# EAGLE design usb2pa_ppwing (EAGLE 6.5.0)
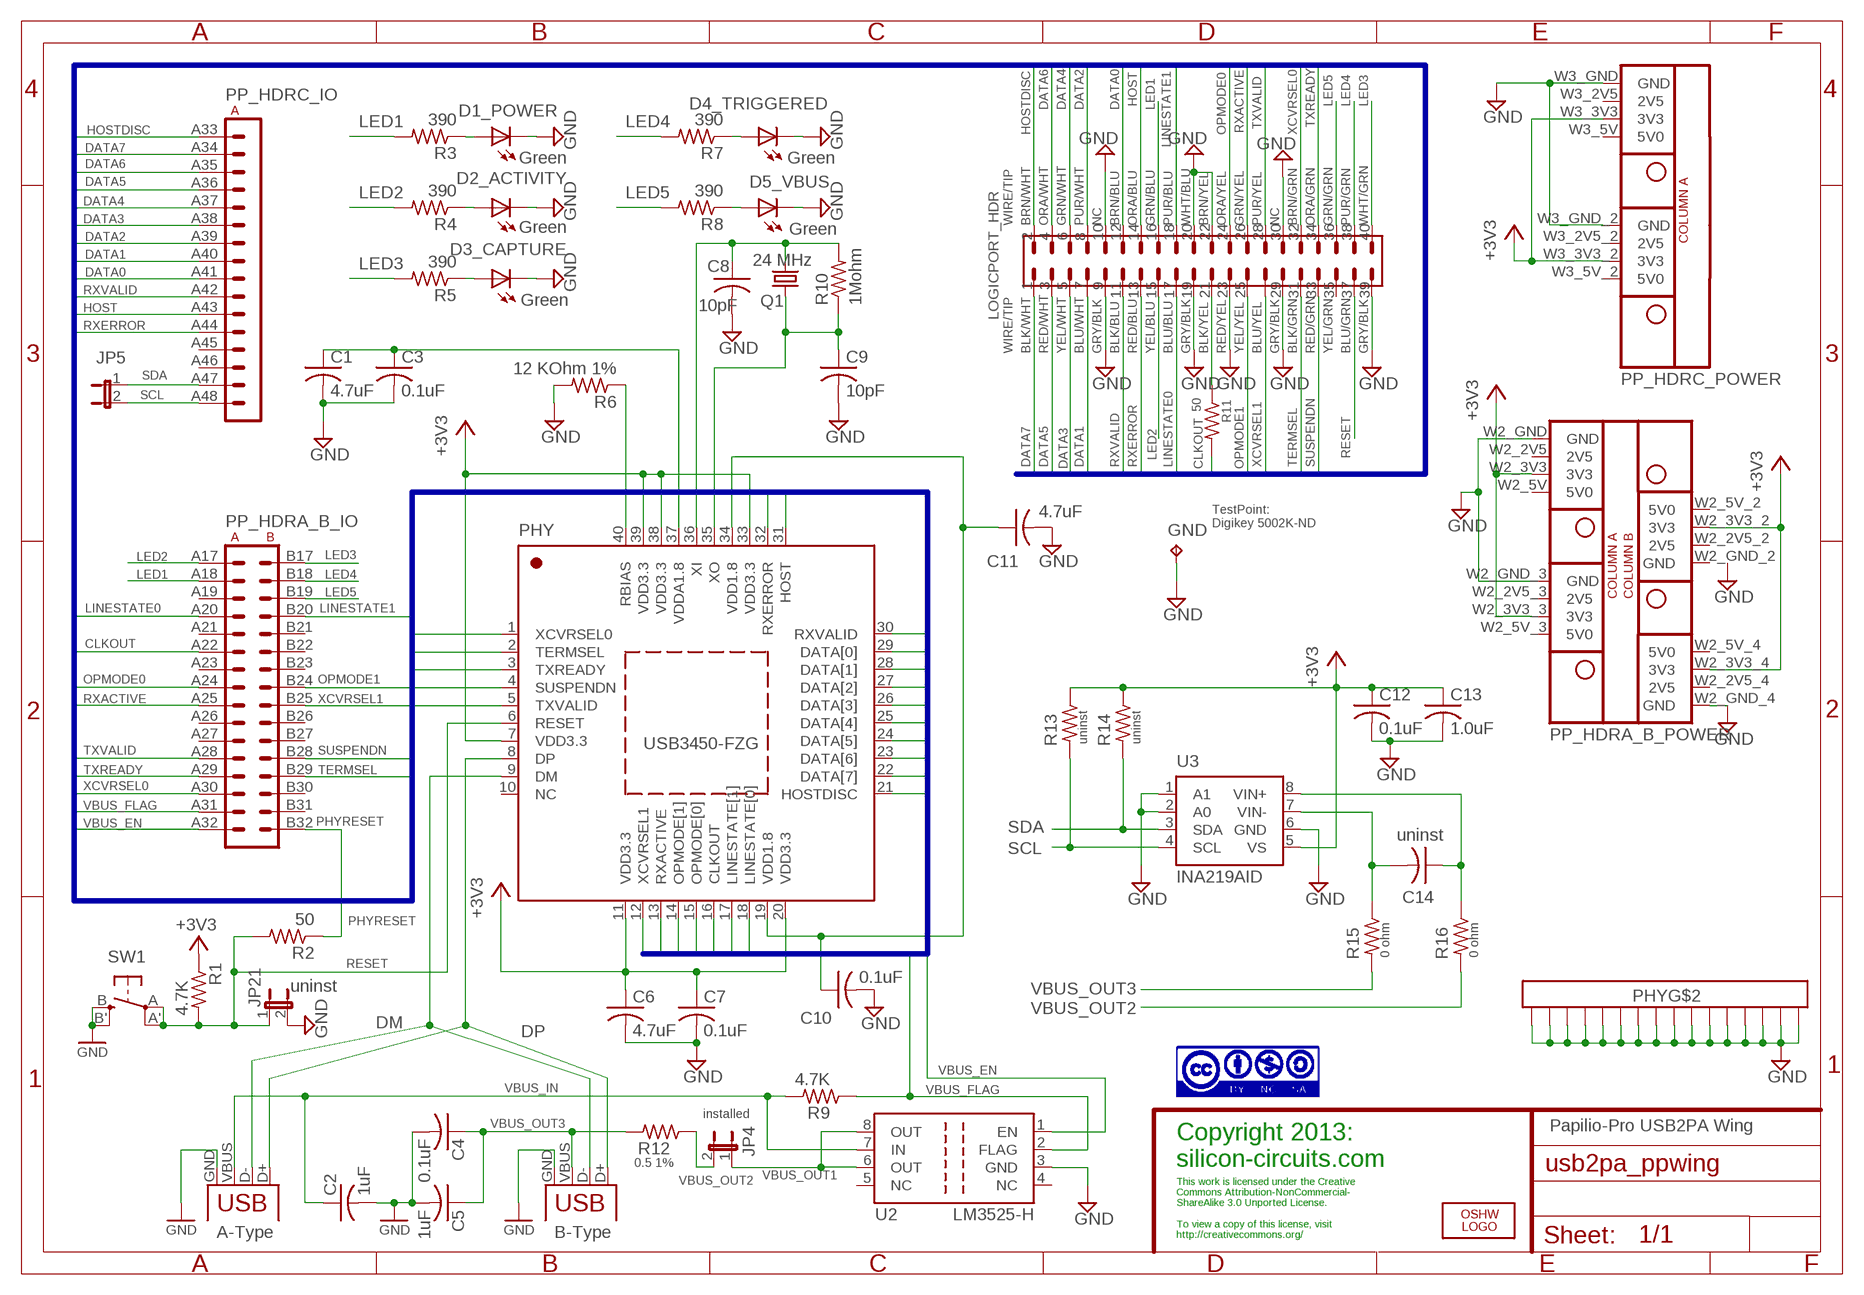
[diagram p0: schematic, sheet 1]

## Parts
C1  4.7uF  C-USC0805  [C0805]
C2  1uF  C-USC0805  [C0805]
C3  0.1uF  C-USC0805  [C0805]
C4  0.1uF  C-USC0805  [C0805]
C5  1uF  C-USC0805  [C0805]
C6  4.7uF  C-USC0805  [C0805]
C7  0.1uF  C-USC0805  [C0805]
C8  10pF  C-USC0805  [C0805]
C9  10pF  C-USC0805  [C0805]
C10  0.1uF  C-USC0805  [C0805]
C11  4.7uF  C-USC0805  [C0805]
C12  0.1uF  C-USC0805  [C0805]
C13  1.0uF  C-USC0805  [C0805]
C14  uninst  C-USC0805  [C0805]
CC_LICENSE  CC_LICENSE  [CC_LICENSE]
D1_POWER  Green  LEDCHIPLED_0805  [CHIPLED_0805]
D2_ACTIVITY  Green  LEDCHIPLED_0805  [CHIPLED_0805]
D3_CAPTURE  Green  LEDCHIPLED_0805  [CHIPLED_0805]
D4_TRIGGERED  Green  LEDCHIPLED_0805  [CHIPLED_0805]
D5_VBUS  Green  LEDCHIPLED_0805  [CHIPLED_0805]
DEVICE  USB-B  USBPTH  [USB-B-PTH]
GND  TPPAD1-13  [P1-13]
HOST  USB-A-FEMALE-SPARKFUN_PRT-09011  [USB_TYPE_A_FEMALE]
JP4  installed  JP1E  [JP1]
JP5  uninst  JP1E  [JP1]
JP21  uninst  JP1E  [JP1]
LOGICPORT_HDR  LOGICPORT_HDR_2X20  [LOGICPORT_2X20_HEADER]
LOGO1  OSHW_LOGO_FILLX0350-NT  [OSHW_FILLX350_NOTEXT]
PHY  USB3450-FZG  [QFN40-6X6]
PP_HDR  MEGAWING_FULL_P1MEGAWING_P1  [MEGAWING_FULL_NOHOLES_P1]
Q1  24 MHz  CRYSTALHC49UP  [HC49UP]
R1  4.7K  R-US_R0805  [R0805]
R2  50  R-US_R0805  [R0805]
R3  390  R-US_R0805  [R0805]
R4  390  R-US_R0805  [R0805]
R5  390  R-US_R0805  [R0805]
R6  12 KOhm 1%  R-US_R0805  [R0805]
R7  390  R-US_R0805  [R0805]
R8  390  R-US_R0805  [R0805]
R9  4.7K  R-US_R0805  [R0805]
R10  1Mohm  R-US_R0805  [R0805]
R11  50  R-US_R0805  [R0805]
R12  0.5 1%  R-US_R0805  [R0805]
R13  uninst  R-US_R0805  [R0805]
R14  uninst  R-US_R0805  [R0805]
R15  0 ohm  R-US_R0805  [R0805]
R16  0 ohm  R-US_R0805  [R0805]
SW1  EVQQ2  [EVQ-Q2]
U2  LM3525-H  [D_R-PDSO-G08]
U3  INA219AID  [D-R-PDSO-G8]

## Nets
+3V3: C6.1 C7.1 C12.1 C13.1 PHY.7(VDD3.3) PHY.11(VDD3.3) PHY.20(VDD3.3) PHY.33(VDD3.3) PHY.38(VDD3.3) PHY.39(VDD3.3) PP_HDR.W2_3V3(A_B_POWER:3V3) PP_HDR.W2_3V3_2(A_B_POWER:3V3) PP_HDR.W2_3V3_3(A_B_POWER:3V3) PP_HDR.W2_3V3_4(A_B_POWER:3V3) PP_HDR.W3_3V3(C_POWER:3V3) PP_HDR.W3_3V3_2(C_POWER:3V3) R1.1 R13.1 R14.1 U3.5(VS)
CLKOUT: PHY.16(CLKOUT) PP_HDR.A22(A_B_IO:A6) R11.2
DATA0: LOGICPORT_HDR.12 PHY.29(DATA[0]) PP_HDR.A41(C_IO:A9)
DATA1: LOGICPORT_HDR.7 PHY.28(DATA[1]) PP_HDR.A40(C_IO:A8)
DATA2: LOGICPORT_HDR.8 PHY.27(DATA[2]) PP_HDR.A39(C_IO:A7)
DATA3: LOGICPORT_HDR.5 PHY.26(DATA[3]) PP_HDR.A38(C_IO:A6)
DATA4: LOGICPORT_HDR.6 PHY.25(DATA[4]) PP_HDR.A37(C_IO:A5)
DATA5: LOGICPORT_HDR.3 PHY.24(DATA[5]) PP_HDR.A36(C_IO:A4)
DATA6: LOGICPORT_HDR.4 PHY.23(DATA[6]) PP_HDR.A35(C_IO:A3)
DATA7: LOGICPORT_HDR.1 PHY.22(DATA[7]) PP_HDR.A34(C_IO:A2)
DM [USB_Data]: DEVICE.D- HOST.D- PHY.9(DM)
DP [USB_Data]: DEVICE.D+ HOST.D+ PHY.8(DP)
GND [Power]: C1.2 C2.2 C3.2 C4.2 C5.2 C6.2 C7.2 C8.2 C9.2 C10.2 C11.2 C12.2 C13.2 D1_POWER.C D2_ACTIVITY.C D3_CAPTURE.C D4_TRIGGERED.C D5_VBUS.C DEVICE.GND GND.TP HOST.GND JP21.2 LOGICPORT_HDR.9 LOGICPORT_HDR.10 LOGICPORT_HDR.19 LOGICPORT_HDR.20 LOGICPORT_HDR.22 LOGICPORT_HDR.23 LOGICPORT_HDR.29 LOGICPORT_HDR.30 LOGICPORT_HDR.39 PHY.GND@1(EXP16) PHY.GND@2(EXP16) PHY.GND@3(EXP16) PHY.GND@4(EXP16) PHY.GND@5(EXP16) PHY.GND@6(EXP16) PHY.GND@7(EXP16) PHY.GND@8(EXP16) PHY.GND@9(EXP16) PHY.GND@10(EXP16) PHY.GND@11(EXP16) PHY.GND@12(EXP16) PHY.GND@13(EXP16) PHY.GND@14(EXP16) PHY.GND@15(EXP16) PHY.GND@16(EXP16) PP_HDR.W2_GND(A_B_POWER:GND) PP_HDR.W2_GND_3(A_B_POWER:GND) PP_HDR.W2_GND_4(A_B_POWER:GND) PP_HDR.W3_GND(C_POWER:GND) PP_HDR.W3_GND_2(C_POWER:GND) R6.2 SW1.B'(S1) SW1.B(S) U2.3(GND) U3.1(A1) U3.2(A0) U3.6(GND)
HOST: LOGICPORT_HDR.14 PHY.31(HOST) PP_HDR.A43(C_IO:A11)
HOSTDISC: LOGICPORT_HDR.2 PHY.21(HOSTDISC) PP_HDR.A33(C_IO:A1)
LED1: LOGICPORT_HDR.16 PP_HDR.A18(A_B_IO:A2) R3.2
LED2: LOGICPORT_HDR.15 PP_HDR.A17(A_B_IO:A1) R4.2
LED3: LOGICPORT_HDR.40 PP_HDR.B17(A_B_IO:B1) R5.2
LED4: LOGICPORT_HDR.38 PP_HDR.B18(A_B_IO:B2) R7.2
LED5: LOGICPORT_HDR.36 PP_HDR.B19(A_B_IO:B3) R8.2
LINESTATE0: LOGICPORT_HDR.17 PHY.18(LINESTATE[0]) PP_HDR.A20(A_B_IO:A4)
LINESTATE1: LOGICPORT_HDR.18 PHY.17(LINESTATE[1]) PP_HDR.B20(A_B_IO:B4)
N$1: LOGICPORT_HDR.21 R11.1
N$3: D2_ACTIVITY.A R4.1
N$4: D3_CAPTURE.A R5.1
N$6: D5_VBUS.A R8.1
N$7: D4_TRIGGERED.A R7.1
N$14: D1_POWER.A R3.1
OPMODE0: LOGICPORT_HDR.24 PHY.15(OPMODE[0]) PP_HDR.A24(A_B_IO:A8)
OPMODE1: LOGICPORT_HDR.25 PHY.14(OPMODE[1]) PP_HDR.B24(A_B_IO:B8)
PHYRESET: PP_HDR.B32(A_B_IO:B16) R2.1
RBIAS: PHY.40(RBIAS) R6.1
RESET: JP21.1 LOGICPORT_HDR.37 PHY.6(RESET) R1.2 R2.2 SW1.A'(P1) SW1.A(P)
RXACTIVE: LOGICPORT_HDR.26 PHY.13(RXACTIVE) PP_HDR.A25(A_B_IO:A9)
RXERROR: LOGICPORT_HDR.13 PHY.32(RXERROR) PP_HDR.A44(C_IO:A12)
RXVALID: LOGICPORT_HDR.11 PHY.30(RXVALID) PP_HDR.A42(C_IO:A10)
SCL: JP5.2 PP_HDR.A48(C_IO:A16) R13.2 U3.4(SCL)
SDA: JP5.1 PP_HDR.A47(C_IO:A15) R14.2 U3.3(SDA)
SUSPENDN: LOGICPORT_HDR.33 PHY.4(SUSPENDN) PP_HDR.B28(A_B_IO:B12)
TERMSEL: LOGICPORT_HDR.31 PHY.2(TERMSEL) PP_HDR.B29(A_B_IO:B13)
TXREADY: LOGICPORT_HDR.34 PHY.3(TXREADY) PP_HDR.A29(A_B_IO:A13)
TXVALID: LOGICPORT_HDR.28 PHY.5(TXVALID) PP_HDR.A28(A_B_IO:A12)
VBUS_EN: PP_HDR.A32(A_B_IO:A16) U2.1(EN)
VBUS_FLAG: PP_HDR.A31(A_B_IO:A15) R9.1 U2.2(FLAG)
VBUS_IN: C2.1 HOST.VBUS R9.2 U2.7(IN)
VBUS_OUT1: JP4.1 U2.6(OUT) U2.8(OUT)
VBUS_OUT2: JP4.2 R12.1 R16.2
VBUS_OUT3: C4.1 C5.1 DEVICE.VBUS R12.2 R15.2
VDD1.8: C10.1 C11.1 PHY.19(VDD1.8) PHY.34(VDD1.8)
VDDA1.8: C1.1 C3.1 PHY.37(VDDA1.8)
VIN+: C14.1 R16.1 U3.8(VIN+)
VIN-: C14.2 R15.1 U3.7(VIN-)
XCVRSEL0: LOGICPORT_HDR.32 PHY.1(XCVRSEL0) PP_HDR.A30(A_B_IO:A14)
XCVRSEL1: LOGICPORT_HDR.27 PHY.12(XCVRSEL1) PP_HDR.B25(A_B_IO:B9)
XI: C8.1 PHY.36(XI) Q1.2 R10.2
XO: C9.1 PHY.35(XO) Q1.1 R10.1
Unconnected: LOGICPORT_HDR.35 PHY.10(NC) PP_HDR.A19(A_B_IO:A3) PP_HDR.A21(A_B_IO:A5) PP_HDR.A23(A_B_IO:A7) PP_HDR.A26(A_B_IO:A10) PP_HDR.A27(A_B_IO:A11) PP_HDR.A45(C_IO:A13) PP_HDR.A46(C_IO:A14) PP_HDR.B21(A_B_IO:B5) PP_HDR.B22(A_B_IO:B6) PP_HDR.B23(A_B_IO:B7) PP_HDR.B26(A_B_IO:B10) PP_HDR.B27(A_B_IO:B11) PP_HDR.B30(A_B_IO:B14) PP_HDR.B31(A_B_IO:B15) PP_HDR.W2_2V5(A_B_POWER:2V5) PP_HDR.W2_2V5_2(A_B_POWER:2V5) PP_HDR.W2_2V5_3(A_B_POWER:2V5) PP_HDR.W2_2V5_4(A_B_POWER:2V5) PP_HDR.W2_5V(A_B_POWER:5V0) PP_HDR.W2_5V_2(A_B_POWER:5V0) PP_HDR.W2_5V_3(A_B_POWER:5V0) PP_HDR.W2_5V_4(A_B_POWER:5V0) PP_HDR.W3_2V5(C_POWER:2V5) PP_HDR.W3_2V5_2(C_POWER:2V5) PP_HDR.W3_5V(C_POWER:5V0) PP_HDR.W3_5V_2(C_POWER:5V0) U2.4(NC) U2.5(NC)

## Buses
XCVRSEL[0..1],TERMSEL,TXREADY,SUSPENDN,TXVALID,PHYRESET,RXACTIVE,OPMODE[0..1],CLKOUT,LINESTATE[0..1],HOSTDISC,DATA[0..7],RXVALID,HOST,RXERROR,VBUS_EN,VBUS_FLAG

## Notes on the sheet
- TestPoint:
  Digikey 5002K-ND
- Papilio-Pro USB2PA Wing
- Copyright 2013:
  silicon-circuits.com
- A-Type | B-Type
- This work is licensed under the Creative 
  Commons Attribution-NonCommercial-
  ShareAlike 3.0 Unported License.
  
  To view a copy of this license, visit
  http://creativecommons.org/

## Power pins joined to a net without a drawn wire
GND: PP_HDR.W2_GND_2(A_B_POWER:GND)

## Library data of the parts
C1-C14 = rcl:C-US: CAPACITOR, American symbol
CC_LICENSE = Cory:CC_LICENSE
D1_POWER D2_ACTIVITY D3_CAPTURE D4_TRIGGERED D5_VBUS = led:LED: LED OSRAM: - CHIPLED LG R971, LG N971, LY N971, LG Q971, LY Q971, LO R971, LY R971 LH N974, LH R974 LS Q976, LO Q976, LY Q976 LO Q996 - Hyper CHIPLED LW Q18S LB Q993, LB Q99A, LB R99A - SideLED LS A670, LO A670, LY A670, LG A670, LP A670 LB A673, LV A673, LT A673, LW A673 LH A674 LY A675 LS A676, LA A676, LO A676, LY A676, LW A676 LS A679, LY A679, LG A679 - Hyper Micro SIDELED® LS Y876, LA Y876, LO Y876, LY Y876 LT Y87S - SmartLED LW L88C, LW L88S LB L89C, LB L89S, LG L890 LS L89K, LO L89K, LY L89K LS L896, LA L896, LO L896, LY L896 - TOPLED LS T670, LO T670, LY T670, LG T670, LP T670 LSG T670, LSP T670, LSY T670, LOP T670, LYG T670 LG T671, LOG T671, LSG T671 LB T673, LV T673, LT T673, LW T673 LH T674 LS T676, LA T676, LO T676, LY T676, LB T676, LH T676, LSB T676, LW T676 LB T67C, LV T67C, LT T67C, LS T67K, LO T67K, LY T67K, LW E67C LS E67B, LA E67B, LO E67B, LY E67B, LB E67C, LV E67C, LT E67C LW T67C LS T679, LY T679, LG T679 LS T770, LO T770, LY T770, LG T770, LP T770 LB T773, LV T773, LT T773, LW T773 LH T774 LS E675, LA E675, LY E675, LS T675 LS T776, LA T776, LO T776, LY T776, LB T776 LHGB T686 LT T68C, LB T68C - Hyper Mini TOPLED® LB M676 - Mini TOPLED Santana® LG M470 LS M47K, LO M47K, LY M47K Source: http://www.osram.convergy.de LUXEON: - LUMILED® LXK2-PW12-R00, LXK2-PW12-S00, LXK2-PW14-U00, LXK2-PW14-V00 LXK2-PM12-R00, LXK2-PM12-S00, LXK2-PM14-U00 LXK2-PE12-Q00, LXK2-PE12-R00, LXK2-PE12-S00, LXK2-PE14-T00, LXK2-PE14-U00 LXK2-PB12-K00, LXK2-PB12-L00, LXK2-PB12-M00, LXK2-PB14-N00, LXK2-PB14-P00, LXK2-PB14-Q00 LXK2-PR12-L00, LXK2-PR12-M00, LXK2-PR14-Q00, LXK2-PR14-R00 LXK2-PD12-Q00, LXK2-PD12-R00, LXK2-PD12-S00 LXK2-PH12-R00, LXK2-PH12-S00 LXK2-PL12-P00, LXK2-PL12-Q00, LXK2-PL12-R00 Source: www.luxeon.com KINGBRIGHT: KA-3528ASYC Source: www.kingbright.com
DEVICE = SparkFun-Connectors:USB: USB Connectors USB-B-PTH is fully proven SKU : PRT-00139/CONN-08278 USB-miniB is fully proven SKU : PRT-00587 USB-A-PCB is untested. USB-A-H is throughly reviewed, but untested. Spark Fun Electronics SKU : PRT-00437 USB-B-SMT is throughly reviewed, but untested. Needs silkscreen touching up. USB-A-S has not been used/tested USB-MB-H has not been used/tested USB-MICROB has been used. CONN-09505; PROD_ID: CONN-08278
GND = testpad:TP: Test pad
HOST = Cory:USB-A-FEMALE-SPARKFUN_PRT-09011; SPARKFUN_PN: PRT-09011
JP4 JP5 JP21 = jumper:JP1E: JUMPER
LOGICPORT_HDR = Cory:LOGICPORT_HDR_2X20: 40pin IDC Header for Intronix LogicPort Logic Analyzer Use an inexpensive IDC compatible ribbon cable to connect this header to the logic analyzer. http://www.pctestinstruments.com
LOGO1 = ohw-logo:OSHW_LOGO_FILL
PHY = smsc:USB3450-FZG: SMSC USB3450-FZG Hi-Speed USB Host or Device PHY with UTMI+ Interface
PP_HDR = Papilio:MEGAWING_FULL_P1
Q1 = crystal:CRYSTAL: CRYSTAL; OC_FARNELL: unknown; OC_NEWARK: unknown
R1-R16 = rcl:R-US_: RESISTOR, American symbol
SW1 = adafruit:EVQQ2: SMT 6mm switch, EVQQ2 series http://www.ladyada.net/library/eagle
U2 = texas:LM3525-H: TI LM3525-H Single Port USB Power Switch and Over-Current Protection http://www.ti.com/lit/gpn/lm3525
U3 = Cory:INA219AID

## Net classes
0 default: width 0.178 mm, drill 0.381 mm, clearance 0.178 mm
1 Power: width 0.61 mm, drill 0.381 mm, clearance 0.178 mm

## Board
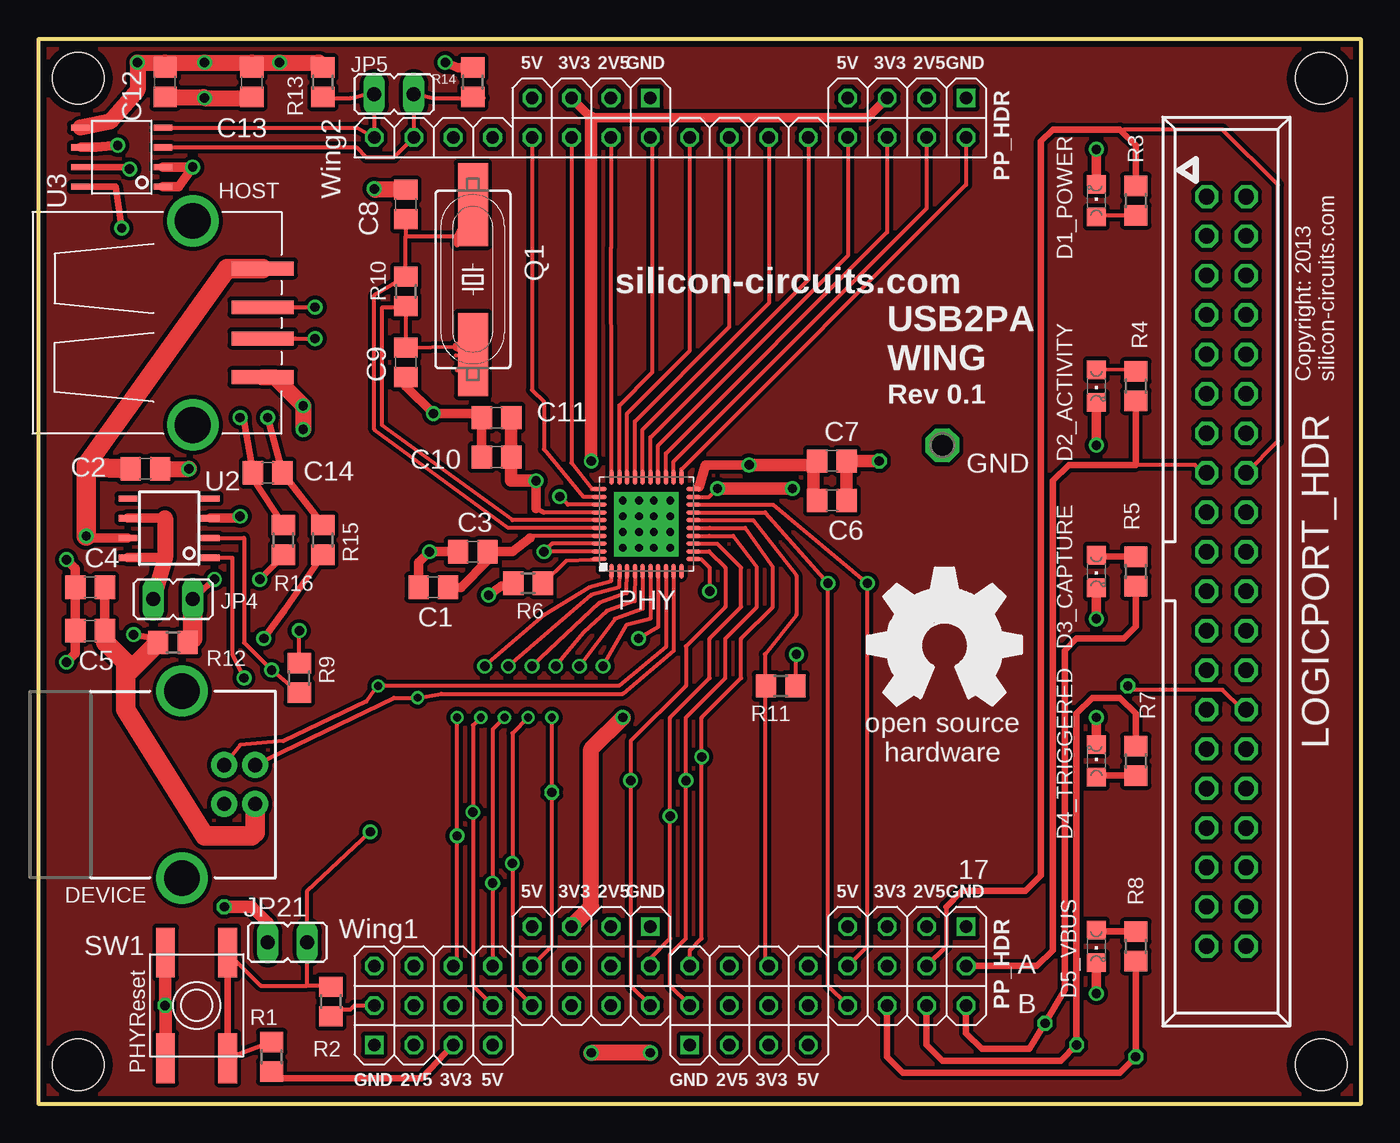
[diagram p1: board, top side]
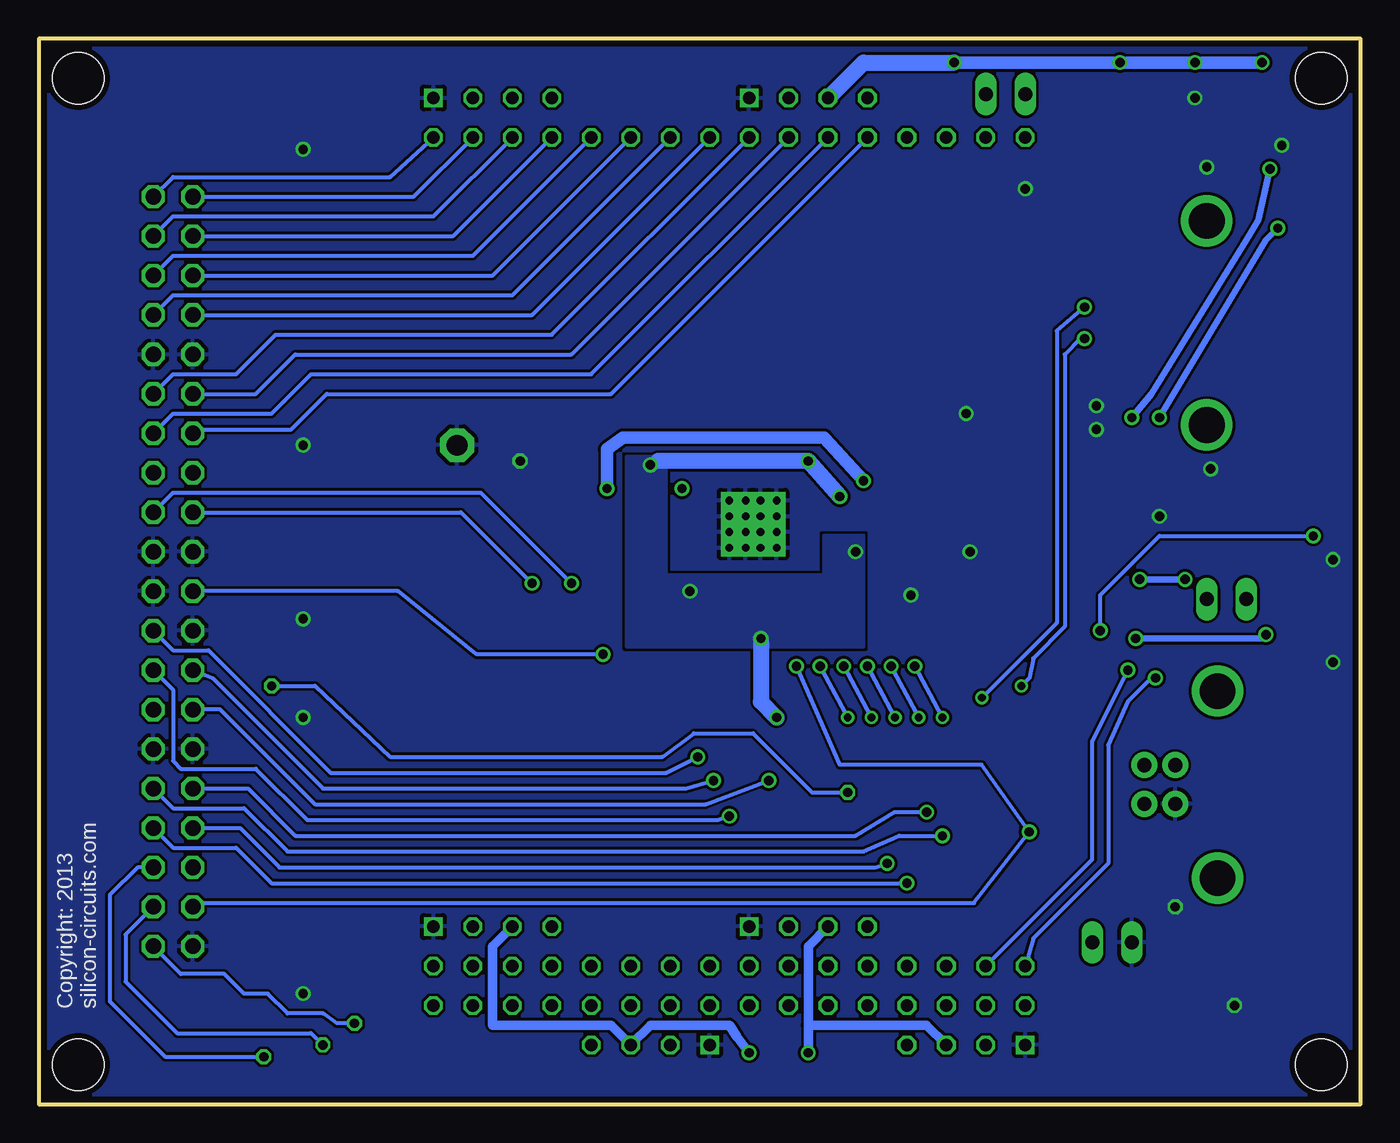
[diagram p2: board, bottom side, seen from below]

Size 85.09 x 68.58 mm. Coordinates in mm from the lower left corner, seen from the top.
Outline: 85.09,68.58 85.09,0 0,0 0,68.58 85.09,68.58
Copper layers (1*16): Top 0.0356mm / dielectric 1.5011mm / Bottom 0.0356mm
Design rules "oshpark": minimum track width 6mil, minimum drill 13mil, track to track 6mil, track to pad 6mil, pad to pad 6mil, via to via 6mil, smd to smd 6mil, copper to edge 15mil, drill to drill 6mil, minimum pad ring 7mil, minimum via ring 7mil, stop-mask expansion 4mil, vias tented up to drill 0mil, thermal gap 10mil

### Footprints (pad centres in the part's own frame; a part is rotated, then mirrored left to right if it is on the bottom)
C0805 = smd 1.3 x 1.5: 1 -0.95,0; 2 0.95,0
CHIPLED_0805 = smd 1.2 x 1.2: A 0,-1.05; C 0,1.05
USB-B-PTH = drill 0.914 pad 1.676: D+ 0,1.25; D- 1.981,1.25; GND 0,-1.25; VBUS 1.981,-1.25 | drill 2.286: S1 -2.718,-6.02; S2 -2.718,6.02
P1-13 = drill 1.321 pad 2.159 octagon: TP 0,0
USB_TYPE_A_FEMALE = smd 4 x 0.9: D+ 4.5,-1; D- 4.5,1; GND 4.5,-3.5; VBUS 4.5,3.5 | drill 2.3: P$5 0,-6.57; P$6 0,6.57
STAND-OFF = hole 3.302: 0,0
JP1 = drill 0.914 long: 1 0,-1.27; 2 0,1.27
LOGICPORT_2X20_HEADER = drill 1 octagon: 1 -24.13,-1.27; 2 -24.13,1.27; 3 -21.59,-1.27; 4 -21.59,1.27; 5 -19.05,-1.27; 6 -19.05,1.27; 7 -16.51,-1.27; 8 -16.51,1.27; 9 -13.97,-1.27; 10 -13.97,1.27; 11 -11.43,-1.27; 12 -11.43,1.27; 13 -8.89,-1.27; 14 -8.89,1.27; 15 -6.35,-1.27; 16 -6.35,1.27; 17 -3.81,-1.27; 18 -3.81,1.27; 19 -1.27,-1.27; 20 -1.27,1.27; 21 1.27,-1.27; 22 1.27,1.27; 23 3.81,-1.27; 24 3.81,1.27; 25 6.35,-1.27; 26 6.35,1.27; 27 8.89,-1.27; 28 8.89,1.27; 29 11.43,-1.27; 30 11.43,1.27; 31 13.97,-1.27; 32 13.97,1.27; 33 16.51,-1.27; 34 16.51,1.27; 35 19.05,-1.27; 36 19.05,1.27; 37 21.59,-1.27; 38 21.59,1.27; 39 24.13,-1.27; 40 24.13,1.27
QFN40-6X6 = smd 0.95 x 0.28: 1 -3.025,2.25; 2 -3.025,1.75; 3 -3.025,1.25; 4 -3.025,0.75; 5 -3.025,0.25; 6 -3.025,-0.25; 7 -3.025,-0.75; 8 -3.025,-1.25; 9 -3.025,-1.75; 10 -3.025,-2.25; 21 3.025,-2.25; 22 3.025,-1.75; 23 3.025,-1.25; 24 3.025,-0.75; 25 3.025,-0.25; 26 3.025,0.25; 27 3.025,0.75; 28 3.025,1.25; 29 3.025,1.75; 30 3.025,2.25 | smd 0.28 x 0.95: 11 -2.25,-3.025; 12 -1.75,-3.025; 13 -1.25,-3.025; 14 -0.75,-3.025; 15 -0.25,-3.025; 16 0.25,-3.025; 17 0.75,-3.025; 18 1.25,-3.025; 19 1.75,-3.025; 20 2.25,-3.025; 31 2.25,3.025; 32 1.75,3.025; 33 1.25,3.025; 34 0.75,3.025; 35 0.25,3.025; 36 -0.25,3.025; 37 -0.75,3.025; 38 -1.25,3.025; 39 -1.75,3.025; 40 -2.25,3.025 | drill 0.5 pad 1.1 square: GND@1 -1.525,1.525; GND@2 -0.5,1.525; GND@3 0.5,1.525; GND@4 1.525,1.525; GND@5 -1.525,0.475; GND@6 -0.5,0.475; GND@7 0.5,0.475; GND@8 1.525,0.475; GND@9 -1.525,-0.475; GND@10 -0.5,-0.475; GND@11 0.5,-0.475; GND@12 1.525,-0.475; GND@13 -1.525,-1.525; GND@14 -0.5,-1.525; GND@15 0.5,-1.525; GND@16 1.525,-1.525
MEGAWING_FULL_NOHOLES_P1 = drill 0.8 octagon: A17 59.69,43.18; A18 59.69,40.64; A19 59.69,38.1; A20 59.69,35.56; A21 59.69,33.02; A22 59.69,30.48; A23 59.69,27.94; A24 59.69,25.4; A25 59.69,22.86; A26 59.69,20.32; A27 59.69,17.78; A28 59.69,15.24; A29 59.69,12.7; A30 59.69,10.16; A31 59.69,7.62; A32 59.69,5.08; A33 6.35,43.18; A34 6.35,40.64; A35 6.35,38.1; A36 6.35,35.56; A37 6.35,33.02; A38 6.35,30.48; A39 6.35,27.94; A40 6.35,25.4; A41 6.35,22.86; A42 6.35,20.32; A43 6.35,17.78; A44 6.35,15.24; A45 6.35,12.7; A46 6.35,10.16; A47 6.35,7.62; A48 6.35,5.08; B17 62.23,43.18; B18 62.23,40.64; B19 62.23,38.1; B20 62.23,35.56; B21 62.23,33.02; B22 62.23,30.48; B23 62.23,27.94; B24 62.23,25.4; B25 62.23,22.86; B26 62.23,20.32; B27 62.23,17.78; B28 62.23,15.24; B29 62.23,12.7; B30 62.23,10.16; B31 62.23,7.62; B32 62.23,5.08; W2_2V5 57.15,40.64; W2_2V5_2 64.77,27.94; W2_2V5_3 57.15,20.32; W2_2V5_4 64.77,7.62; W2_3V3 57.15,38.1; W2_3V3_2 64.77,30.48; W2_3V3_3 57.15,17.78; W2_3V3_4 64.77,10.16; W2_5V 57.15,35.56; W2_5V_2 64.77,33.02; W2_5V_3 57.15,15.24; W2_5V_4 64.77,12.7; W3_2V5 3.81,40.64; W3_2V5_2 3.81,20.32; W3_3V3 3.81,38.1; W3_3V3_2 3.81,17.78; W3_5V 3.81,35.56; W3_5V_2 3.81,15.24 | drill 0.8 square: W2_GND 57.15,43.18; W2_GND_2 64.77,25.4; W2_GND_3 57.15,22.86; W2_GND_4 64.77,5.08; W3_GND 3.81,43.18; W3_GND_2 3.81,22.86
HC49UP = smd 5.334 x 1.93: 1 -4.826,0; 2 4.826,0
R0805 = smd 1.3 x 1.5: 1 -0.95,0; 2 0.95,0
EVQ-Q2 = smd 3.2 x 1.2: A -3.4,-2; A' 3.4,-2; B -3.4,2; B' 3.4,2
D_R-PDSO-G08 = smd 0.4 x 1.2: 1 -1.905,-2.65; 2 -0.635,-2.65; 3 0.635,-2.65; 4 1.905,-2.65; 5 1.905,2.65; 6 0.635,2.65; 7 -0.635,2.65; 8 -1.905,2.65
D-R-PDSO-G8 = smd 0.4 x 1.2: 1 -1.905,-2.65; 2 -0.635,-2.65; 3 0.635,-2.65; 4 1.905,-2.65; 5 1.905,2.65; 6 0.635,2.65; 7 -0.635,2.65; 8 -1.905,2.65

### Placement (x,y rotation side)
C1  25.4,33.27 180 top
C2  6.86,40.89 0 top
C3  27.94,35.56 180 top
C4  3.3,33.27 180 top
C5  3.3,30.48 180 top
C6  51.05,38.86 0 top
C7  51.05,41.4 0 top
C8  23.62,57.91 90 top
C9  23.62,47.75 270 top
C10  29.46,41.66 180 top
C11  29.46,44.2 180 top
C12  8.13,65.79 270 top
C13  13.72,65.79 270 top
C14  14.73,40.64 0 top
CC_LICENSE  63.2,63.86 0 top
D1_POWER  68.07,58.17 0 top
D2_ACTIVITY  68.07,46.23 180 top
D3_CAPTURE  68.07,34.29 180 top
D4_TRIGGERED  68.07,22.1 0 top
D5_VBUS  68.07,10.16 180 top
DEVICE  11.94,20.57 0 top
GND  58.17,42.42 0 top
HOST  9.91,50.29 0 top
JP1  STAND-OFF  [STAND-OFF]  2.54,66.04 270 top
JP2  STAND-OFF  [STAND-OFF]  2.54,2.54 270 top
JP3  STAND-OFF  [STAND-OFF]  82.55,2.54 270 top
JP4  8.64,32.51 270 top
JP5  22.86,65.02 90 top
JP7  STAND-OFF  [STAND-OFF]  82.55,66.04 270 top
JP21  16,10.41 90 top
LOGICPORT_HDR  76.45,34.29 270 top
LOGO1  53.34,25.65 0 top
PHY  39.12,37.34 90 top
PP_HDR  16.51,68.58 270 top
Q1  27.94,53.09 90 top
R1  14.99,3.05 90 top
R2  18.8,6.6 90 top
R3  70.61,58.17 90 top
R4  70.61,46.23 270 top
R5  70.61,34.29 270 top
R6  31.5,33.53 180 top
R7  70.61,22.1 90 top
R8  70.61,10.16 270 top
R9  16.76,27.43 90 top
R10  23.62,52.32 90 top
R11  47.75,26.92 180 top
R12  8.64,29.72 180 top
R13  18.29,65.79 270 top
R14  27.94,65.79 270 top
R15  18.29,36.32 270 top
R16  15.75,36.32 270 top
SW1  10.16,6.35 90 top
U2  8.38,37.08 90 top
U3  5.33,60.96 90 top

### Tracks (layer width: path | path; a pad name or v marks a point on that pad's centre or on a via)
+3V3  (via drill 0.6)
  Top 0.254: PHY.7 39.87,30.72 v38.61,29.97 | PHY.20 42.51,39.72 | PHY.11 42.64,35.09 43.18,34.54 v43.18,33.02 | PHY.39 32.77,35.59 32.77,35.81 | PHY.33 34.06,38.59 v33.53,39.12 | PHY.38 33.04,36.09 v32.51,35.56
  Top 0.305: R1.1 15.49,1.78 15.62,1.78 15.75,1.65
  Top 0.406: 32.77,35.81 v32.51,35.56 | PP_HDR.W2_3V3_4 24.64,1.65 15.75,1.65
  Top 0.61: 42.51,39.72 42.93,41.15 v45.72,41.15 | PP_HDR.W3_3V3_2 35.56,63.5 53.34,63.5 PP_HDR.W3_3V3 | R14.1 26.99,66.74 v26.16,67.06
  Top 0.813: v35.56,41.4 35.56,63.5 | v45.72,41.15 49.85,41.15 | 49.85,41.15 C7.1 | 49.85,41.15 49.85,39.12 C6.1
  Top 1.016: PP_HDR.W2_3V3_3 35.56,12.7 35.56,22.86 v37.59,24.89 | v39.37,3.3 v35.56,3.3 | 17.97,67.06 v15.49,67.06 13.72,67.06 | 18.03,67.06 17.97,67.06 | 17.97,67.06 R13.1 | 8.13,67.06 v10.67,67.06 13.72,67.06 | 8.13,67.06 v6.35,67.06 6.35,65.28 4.59,63.25 U3.5 | C12.1 8.13,67.06 | C13.1 13.72,67.06
  Bottom 0.406: 45.21,41.4 v45.72,41.15
  Bottom 0.61: PP_HDR.W2_3V3_3 35.56,10.16 35.56,5.08 | PP_HDR.W2_3V3 55.88,10.16 55.88,5.08 48.26,5.08 PP_HDR.W2_3V3_2 45.72,5.08 40.64,5.08 40.13,4.32 v39.37,3.3 | PP_HDR.W2_3V3_4 27.94,5.08 35.56,5.08 | 35.56,5.08 v35.56,3.3
  Bottom 0.813: v26.16,67.06 v15.49,67.06 v10.67,67.06 v6.35,67.06
  Bottom 1.016: v33.53,39.12 v35.56,41.4 45.21,41.4 | v38.61,29.97 38.61,25.91 v37.59,24.89 | PP_HDR.W3_3V3_2 32,67.06 v26.16,67.06
  pour Bottom: 44.7,41.66 47.24,41.66 47.24,29.46 32,29.46 32,36.58 34.54,36.58 34.54,34.04 44.7,34.04
CLKOUT
  Top 0.254: PHY.16 43.18,37.59 | 43.18,37.59 | 43.18,37.59 45.98,37.59 48.77,34.04 48.77,31.5 46.74,28.96 46.74,27.43 46.74,26.92 | 46.74,26.92 46.74,9.14 PP_HDR.A22 | R11.2 46.74,26.92
DATA0
  Top 0.254: PHY.29 37.37,44.99 39.5,47.12 39.5,62.1 PP_HDR.A41
  Bottom 0.254: LOGICPORT_HDR.12 76.45,46.99 72.39,46.99 69.85,49.53 52.07,49.53 PP_HDR.A41
DATA1
  Top 0.254: PHY.28 37.87,44.47 41.91,48.51 PP_HDR.A40
  Bottom 0.254: LOGICPORT_HDR.7 53.34,50.8 PP_HDR.A40
DATA2
  Top 0.254: PHY.27 38.37,43.95 44.45,50.04 PP_HDR.A39
  Bottom 0.254: LOGICPORT_HDR.8 76.45,52.07 54.61,52.07 PP_HDR.A39
DATA3
  Top 0.254: PHY.26 38.87,43.44 46.99,51.56 PP_HDR.A38
  Bottom 0.254: LOGICPORT_HDR.5 55.88,53.34 PP_HDR.A38
DATA4
  Top 0.254: PHY.25 39.37,42.92 49.53,53.09 PP_HDR.A37
  Bottom 0.254: LOGICPORT_HDR.6 76.45,54.61 57.15,54.61 PP_HDR.A37
DATA5
  Top 0.254: PHY.24 39.87,42.41 52.07,54.61 PP_HDR.A36
  Bottom 0.254: LOGICPORT_HDR.3 58.42,55.88 PP_HDR.A36
DATA6
  Top 0.254: PHY.23 40.37,41.89 54.61,56.13 PP_HDR.A35
  Bottom 0.254: LOGICPORT_HDR.4 76.45,57.15 59.69,57.15 PP_HDR.A35
DATA7
  Top 0.254: PHY.22 40.87,41.37 57.15,57.66 PP_HDR.A34
  Bottom 0.254: LOGICPORT_HDR.1 60.96,58.42 PP_HDR.A34
DM  (via drill 0.5, 0.6)
  Top 0.254: PHY.9 40.87,29.18 37.59,26.42 25.91,26.42 v24.38,26.16 22.86,26.16 DEVICE.D- | HOST.D- 14.42,51.31 v17.78,51.31
  Bottom 0.254: v17.78,51.31 19.56,49.78 19.56,30.99 v24.38,26.16
DP  (via drill 0.5, 0.6)
  Top 0.254: PHY.8 40.37,29.44 37.34,26.92 v21.84,26.92 21.59,26.67 21.08,25.91 15.75,23.37 12.95,23.11 DEVICE.D+ | HOST.D+ 16.51,49.29 16.51,49.28 v17.78,49.28
  Bottom 0.254: v17.78,49.28 18.03,49.28 19.05,48.26 19.05,30.73 21.08,28.7 21.34,27.43 v21.84,26.92
GND  (via drill 0.6)
  Top 0.61: v5.08,61.72 3.7,61.59 U3.6 | U3.2 v9.91,60.33 9.02,59.05 U3.1 | v1.78,35.05 2.35,34.48 C4.2 C5.2 2.35,29.02 v1.78,28.45 | U2.3 12.83,37.72 v12.95,37.85 | C9.2 23.62,46.23 v25.4,44.45 28.26,44.45 C11.2 C10.2 | C3.2 v25.15,35.56 24.45,34.86 C1.2 | R6.2 29.78,33.34 v28.96,32.77 | D5_VBUS.C v68.07,7.11 | D3_CAPTURE.C v68.07,31.24 | D2_ACTIVITY.C v68.07,42.42 | D1_POWER.C v68.07,61.47 | D4_TRIGGERED.C v68.07,24.89
  Top 0.813: v54.1,41.4 C7.2 C6.2 | JP21.2 14.73,11.68 13.72,12.7 v11.94,12.7 | SW1.B 8.16,6.32 v8.13,6.35 8.13,9.72 SW1.B'
  Top 1.016: C12.2 10.6,64.84 v10.67,64.77 13.65,64.77 C13.2 | C8.2 21.66,58.86 v21.59,58.93 | C2.2 v9.65,40.89 | HOST.GND 15.18,46.79 v17.02,44.96 v17.02,43.43
  pour Bottom (rank 2): -1.27,69.85 -1.27,-1.27 86.36,-1.27 86.36,69.85
HOST
  Top 0.254: PHY.31 35.6,39.59 34.29,41.27 PP_HDR.A43
  Bottom 0.254: LOGICPORT_HDR.14 76.45,44.45 70.1,44.45 67.56,46.99 49.53,46.99 PP_HDR.A43
HOSTDISC
  Top 0.254: PHY.21 41.37,40.86 59.69,59.18 PP_HDR.A33
  Bottom 0.254: LOGICPORT_HDR.2 76.45,59.69 62.48,59.69 PP_HDR.A33
LED1
  Top 0.254: LOGICPORT_HDR.16 79.76,42.67 79.76,59.18 76.2,62.74 69.85,62.74 69.72,62.61
  Top 0.305: PP_HDR.A18 58.42,10.16 58.42,12.7
  Top 0.406: 58.42,12.7 59.44,13.72 63.5,13.72 64.52,14.73 64.52,61.98 65.28,62.74 69.6,62.74 69.72,62.61 70.61,61.72 R3.2
LED2
  Top 0.254: LOGICPORT_HDR.15 74.93,40.64 74.42,41.15 70.61,41.15
  Top 0.406: PP_HDR.A17 64.26,8.89 65.28,9.91 65.28,40.13 66.29,41.15 70.61,41.15 R4.2
LED3  (via drill 0.6)
  Top 0.406: PP_HDR.B17 59.69,4.57 60.71,3.56 63.75,3.56 v64.77,5.21 66.04,7.37 66.04,29.21 66.8,29.97 69.85,29.97 70.61,30.73 R5.2
  Bottom 0.254: v64.77,5.21 65.91,5.21 66.8,5.84 69.09,5.84 70.36,7.11 71.88,7.11 73.15,8.38 75.95,8.38 LOGICPORT_HDR.40
LED4  (via drill 0.6)
  Top 0.406: R7.2 70.61,25.15 69.6,26.16 67.82,26.16 66.8,25.15 v66.8,3.81 65.79,2.79 58.17,2.79 57.15,3.81 PP_HDR.B18
  Bottom 0.254: LOGICPORT_HDR.38 79.5,10.92 79.5,7.87 76.2,4.57 67.56,4.57 v66.8,3.81
LED5  (via drill 0.6)
  Top 0.406: PP_HDR.B19 54.61,3.05 55.63,2.03 69.6,2.03 v70.61,3.05 R8.2
  Bottom 0.254: LOGICPORT_HDR.36 78.74,15.24 80.52,13.46 80.52,6.6 76.96,3.05 v70.61,3.05
LINESTATE0  (via drill 0.6)
  Top 0.254: PHY.18 47.26,38.59 v53.34,33.53 53.34,10.16 PP_HDR.A20
  Bottom 0.254: LOGICPORT_HDR.17 57.91,38.1 v53.34,33.53
LINESTATE1  (via drill 0.6)
  Top 0.254: PHY.17 46.75,38.09 v50.8,33.53 50.8,7.62 PP_HDR.B20
  Bottom 0.254: LOGICPORT_HDR.18 76.45,39.37 56.64,39.37 v50.8,33.53
N$1  (via drill 0.6)
  Top 0.254: R11.1 v48.77,28.96
  Bottom 0.254: v48.77,28.96 56.9,28.96 61.98,33.02 LOGICPORT_HDR.21
N$2
  pour Top (isolate 0.254): -0.25,-0.25 85.34,-0.25 85.34,68.83 -0.25,68.83
N$3
  Top 0.254: D2_ACTIVITY.A 70.33,47.3 R4.1
N$4
  Top 0.254: D3_CAPTURE.A 68.17,35.24
  Top 0.406: 68.17,35.24 R5.1
N$6
  Top 0.254: D5_VBUS.A 68.17,11.11
  Top 0.406: 68.17,11.11 R8.1
N$7
  Top 0.254: D4_TRIGGERED.A 68.17,21.15
  Top 0.406: 68.17,21.15 R7.1
N$14
  Top 0.254: D1_POWER.A 68.17,57.22 R3.1
OPMODE0  (via drill 0.6)
  Top 0.254: 43.18,37.09 PHY.15 45.46,37.09 47.24,34.54 47.24,32 45.21,29.97 45.21,27.43 42.67,24.89 v42.67,22.35 42.67,10.67 41.91,9.91 PP_HDR.A24
  Bottom 0.254: LOGICPORT_HDR.24 76.45,29.21 74.17,29.21 66.29,21.34 44.7,21.34 v42.67,22.35
OPMODE1  (via drill 0.6)
  Top 0.254: 43.17,36.59 PHY.14 44.69,36.59 46.23,34.54 46.23,32 44.2,29.97 44.2,27.43 41.66,24.89 v41.66,20.83 41.66,10.67 40.64,9.65 40.64,7.62 PP_HDR.B24
  Bottom 0.254: LOGICPORT_HDR.25 73.91,27.43 66.8,20.32 43.43,20.32 v41.66,20.83
PHYRESET
  Top 0.254: 19.54,6.1 20.07,6.1 20.32,6.35 PP_HDR.B32
  Top 0.305: 19.54,6.1 R2.1
RBIAS
  Top 0.254: R6.1 33.97,34.99 35.56,35.05 36.05,35.05 PHY.40
RESET  (via drill 0.6)
  Top 0.254: PHY.6 39.37,31.24 37.85,30.86 v36.32,28.19 | v21.34,17.53 17.27,13.73 JP21.1 17.27,7.62 | SW1.A' 14.29,7.62 17.27,7.62 | 19.03,7.62 17.27,7.62
  Top 0.305: 19.03,7.62 R2.2 | SW1.A R1.2
  Top 0.406: SW1.A SW1.A'
  Bottom 0.254: v36.32,28.19 33.53,21.84 24.38,21.84 v21.34,17.53 24.89,12.95 74.68,12.95 LOGICPORT_HDR.37
RXACTIVE  (via drill 0.6)
  Top 0.254: 43.16,36.09 PHY.13 43.67,36.09 45.21,34.54 45.21,32 43.18,29.97 43.18,27.43 40.64,24.89 v40.64,18.54 40.64,10.67 39.37,9.4 PP_HDR.A25
  Bottom 0.254: LOGICPORT_HDR.26 76.45,26.67 76.45,22.1 75.95,21.59 71.12,21.59 67.82,18.29 41.4,18.29 v40.64,18.54
RXERROR
  Top 0.254: PHY.32 35.08,39.09 32.51,42.16 32.51,45.21 31.75,45.97 PP_HDR.A44
  Bottom 0.254: LOGICPORT_HDR.13 74.68,43.43 68.83,43.43 66.55,45.72 48.26,45.72 PP_HDR.A44
RXVALID
  Top 0.254: PHY.30 36.87,45.25 36.83,55.12 PP_HDR.A42
  Bottom 0.254: LOGICPORT_HDR.11 71.12,45.72 68.58,48.26 50.8,48.26 PP_HDR.A42
SCL
  Top 0.254: U3.4 20.45,62.87 PP_HDR.A48 JP5.2 21.08,65.02 20.07,64.77 18.35,64.77 R13.2
SDA
  Top 0.254: R14.2 28.64,64.77 25.4,64.77 24.38,65.02 JP5.1 PP_HDR.A47 22.86,60.96 21.08,60.96 20.45,61.59 U3.3
SUSPENDN  (via drill 0.5, 0.6)
  Top 0.254: PHY.4 38.35,32.38 36.58,31.75 35.05,30.35 v33.27,28.19 | v31.5,24.89 30.48,23.88 v30.48,15.49 30.48,7.62 PP_HDR.B28
  Bottom 0.254: v31.5,24.89 v33.27,28.19 | LOGICPORT_HDR.33 72.14,17.78 69.6,15.24 31.24,15.24 v30.48,15.49
TERMSEL  (via drill 0.5, 0.6)
  Top 0.254: PHY.2 37.34,33.27 35.56,32.77 v30.23,28.19 | v28.45,24.89 27.94,24.38 v27.94,18.8 27.94,7.62 PP_HDR.B29
  Bottom 0.254: v28.45,24.89 v30.23,28.19 | LOGICPORT_HDR.31 71.63,20.32 68.58,17.27 32.51,17.27 29.97,18.8 v27.94,18.8
TXREADY  (via drill 0.5, 0.6)
  Top 0.254: v31.75,28.19 36.07,32.26 37.85,32.89 PHY.3 | v29.97,24.89 29.21,24.13 v29.21,14.22 PP_HDR.A29
  Bottom 0.254: v29.97,24.89 v31.75,28.19 | v29.21,14.22 70.1,14.22 72.39,16.51 76.45,16.51 LOGICPORT_HDR.34
TXVALID  (via drill 0.5, 0.6)
  Top 0.254: PHY.5 38.86,31.88 37.08,31.24 v34.8,28.19 | v33.02,24.89 v33.02,20.07 33.02,10.16 PP_HDR.A28 | LOGICPORT_HDR.28 77.47,25.4 76.2,26.67 70.36,26.67 v70.1,26.92
  Bottom 0.254: v33.02,24.89 v34.8,28.19 | v70.1,26.92 67.31,26.92 62.48,22.35 44.96,22.35 42.93,23.88 39.12,23.88 35.31,20.07 v33.02,20.07
VBUS_EN  (via drill 0.6)
  Top 0.254: U2.1 12.45,35.18 12.45,28.96 v13.21,27.43
  Bottom 0.254: v13.21,27.43 13.46,27.43 14.99,25.91 16.26,23.11 16.26,15.49 21.08,10.67 PP_HDR.A32
VBUS_FLAG  (via drill 0.6)
  Top 0.254: U2.2 13.21,36.45 13.21,29.72 v14.99,27.94 R9.1
  Bottom 0.254: PP_HDR.A31 17.27,15.75 17.27,23.37 v14.99,27.94
VBUS_IN  (via drill 0.6)
  Top 0.254: R9.2 v16.76,30.48
  Top 0.61: U2.7 3.17,36.45 v3.05,36.58
  Top 1.016: 3.05,41.15 3.05,41.02
  Top 1.27: 3.05,41.15 12.14,53.79 HOST.VBUS | v3.05,36.58 3.05,41.02 C2.1
  Bottom 0.254: v16.76,30.48 16.76,32.77 12.95,36.58 v3.05,36.58
VBUS_OUT1
  Top 0.61: U2.6 8.13,37.72 | U2.8 8.13,35.18
  Top 1.016: JP4.1 8.13,35.18 8.13,37.72
VBUS_OUT2  (via drill 0.6)
  Top 0.305: R16.2 15.75,35.31
  Top 0.406: 15.75,35.31 v14.22,33.78 | v11.3,33.78 JP4.2
  Top 1.27: R12.1 9.65,29.72 9.91,29.97 JP4.2
  Bottom 0.305: JP4.2 9.91,31.75
  Bottom 0.406: v14.22,33.78 v11.3,33.78
VBUS_OUT3  (via drill 0.6)
  Top 0.305: 7.43,29.97 R12.2
  Top 0.406: R15.2 15.81,31.82 v14.48,29.97 | v6.1,30.23 7.43,29.97
  Top 0.61: C4.1 C5.1
  Top 1.016: 13.92,17.48 13.72,17.27
  Top 1.27: DEVICE.VBUS 13.92,17.48 | 13.72,17.27 10.67,17.27 5.59,25.4 5.59,27.62 | 5.59,27.62 R12.2 | 5.59,27.62 5.59,28.45 4.32,29.72 4.32,30.41 C5.1
  Bottom 0.305: 6.35,29.97 v6.1,30.23
  Bottom 0.406: v14.48,29.97 6.35,29.97
VDD1.8  (via drill 0.6)
  Top 0.254: PHY.19 43.15,39.09 v43.69,39.62 | PHY.34 32.51,38.1 | 32,38.34 32.02,38.34
  Top 0.305: 32.51,38.1 32,38.34
  Top 0.61: 32.02,38.34 v32,40.13 | C11.1 C10.1
  Top 0.813: v48.51,39.62 v43.69,39.62 | C11.1 30.41,40.13 v32,40.13
  Bottom 0.813: v32,40.13 34.54,42.93 47.5,42.93 48.51,42.16 v48.51,39.62
VDDA1.8
  Top 0.254: PHY.37 31.51,36.59 31.62,36.45
  Top 0.61: 31.62,36.45 30.48,35.56 C3.1 28.89,34.99 27.18,33.27 C1.1
VIN+  (via drill 0.6)
  Top 0.406: U3.8 4.95,59.05 v5.33,56.39 | v12.95,44.2 13.21,43.94 C14.1 13.78,40.25 R16.1
  Bottom 0.406: v5.33,56.39 6.1,55.63 v12.95,44.2
VIN-  (via drill 0.6)
  Top 0.406: U3.7 5.71,60.33 v5.84,60.2 | v14.73,44.2 C14.2 R15.1
  Bottom 0.406: v5.84,60.2 6.6,56.9 7.37,55.63 13.46,45.72 v14.73,44.2
XCVRSEL0  (via drill 0.5, 0.6)
  Top 0.254: v28.7,28.19 32.51,31.5 35.43,33.27 36.83,33.66 36.83,34.04 PHY.1 | PP_HDR.A30 26.92,9.14 v26.92,17.27 v26.92,24.89
  Bottom 0.254: v26.92,24.89 v28.7,28.19 | LOGICPORT_HDR.32 76.45,19.05 71.88,19.05 69.09,16.26 32,16.26 29.72,17.27 v26.92,17.27
XCVRSEL1  (via drill 0.6)
  Top 0.254: PHY.12 43.15,35.59 44.2,34.54 44.2,32 41.66,29.46 41.66,26.92 38.1,23.37 v38.1,20.83 38.1,7.62 PP_HDR.B25
  Bottom 0.254: v38.1,20.83 42.16,19.3 67.31,19.3 73.41,25.4 LOGICPORT_HDR.27
XI
  Top 0.254: PHY.36 30.23,37.09 21.59,43.43 21.59,52.07 R10.2 23.62,55.88 | 23.62,55.88 26.92,55.88 | C8.1 23.62,55.88
  Top 0.406: Q1.2 26.92,55.88 26.92,55.37
XO
  Top 0.254: PHY.35 30.48,37.59 22.1,43.69 22.1,51.31 23.62,51.31 C9.1 26.92,48.77 | 26.86,48.19 Q1.1 26.92,47.24
  Top 0.406: 23.62,51.31 R10.1
  Top 0.61: 26.92,48.77 Q1.1

### Text on the board
tPlace: silicon-circuits.com | USB2PA / WING | Copyright: 2013 / silicon-circuits.com | Rev 0.1 | open source / hardware
bPlace: Copyright: 2013 / silicon-circuits.com
tNames: Wing2 | 17 | Wing1 | PHYReset | A | B